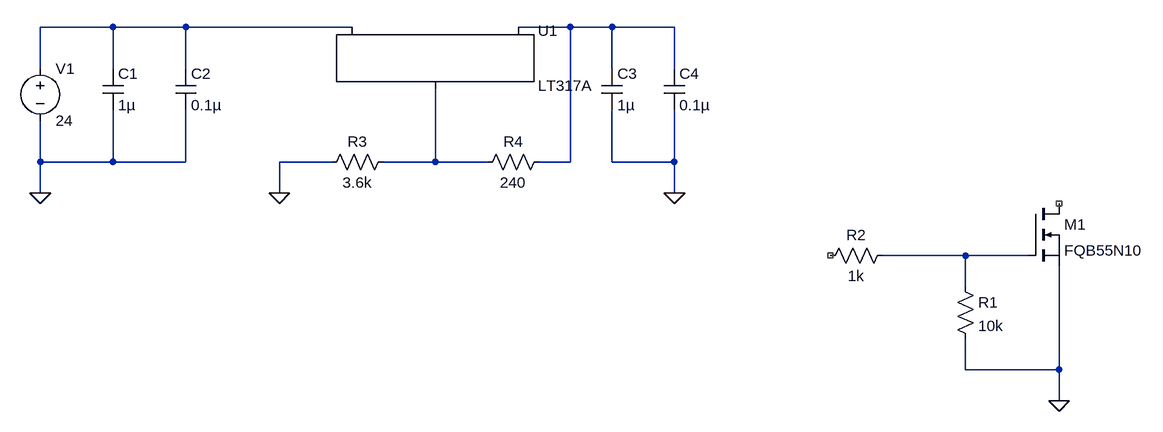
[diagram p0: schematic OverCurrent.asc]
OverCurrent.asc, the LTspice schematic file:
Version 4
SHEET 1 1096 680
WIRE -496 80 -608 80
WIRE -384 80 -496 80
WIRE -128 80 -384 80
WIRE 208 80 128 80
WIRE 272 80 208 80
WIRE 368 80 272 80
WIRE -608 144 -608 80
WIRE -496 144 -496 80
WIRE -384 144 -384 80
WIRE 272 144 272 80
WIRE 368 144 368 80
WIRE -608 288 -608 224
WIRE -496 288 -496 208
WIRE -496 288 -608 288
WIRE -384 288 -384 208
WIRE -384 288 -496 288
WIRE -160 288 -240 288
WIRE 0 288 0 176
WIRE 0 288 -80 288
WIRE 80 288 0 288
WIRE 208 288 208 80
WIRE 208 288 160 288
WIRE 272 288 272 208
WIRE 368 288 368 208
WIRE 368 288 272 288
WIRE -608 336 -608 288
WIRE -240 336 -240 288
WIRE 368 336 368 288
WIRE 816 432 688 432
WIRE 912 432 816 432
WIRE 816 480 816 432
WIRE 816 608 816 560
WIRE 960 608 960 448
WIRE 960 608 816 608
WIRE 960 656 960 608
FLAG 960 656 0
FLAG -608 336 0
FLAG -240 336 0
FLAG 368 336 0
SYMBOL PowerProducts\\LT317A 0 80 R0
SYMATTR InstName U1
SYMBOL nmos 912 352 R0
SYMATTR InstName M1
SYMATTR Value FQB55N10
SYMBOL res 800 464 R0
SYMATTR InstName R1
SYMATTR Value 10k
SYMATTR SpiceLine pwr=0.125
SYMBOL res 704 416 R90
WINDOW 0 0 56 VBottom 2
WINDOW 3 32 56 VTop 2
SYMATTR InstName R2
SYMATTR Value 1k
SYMATTR SpiceLine pwr=0.125
SYMBOL voltage -608 128 R0
WINDOW 123 0 0 Left 0
WINDOW 39 0 0 Left 0
SYMATTR InstName V1
SYMATTR Value 24
SYMBOL cap -512 144 R0
SYMATTR InstName C1
SYMATTR Value 1µ
SYMATTR SpiceLine V=50
SYMBOL cap -400 144 R0
SYMATTR InstName C2
SYMATTR Value 0.1µ
SYMATTR SpiceLine V=50
SYMBOL res -64 272 R90
WINDOW 0 0 56 VBottom 2
WINDOW 3 32 56 VTop 2
SYMATTR InstName R3
SYMATTR Value 3.6k
SYMATTR SpiceLine pwr=0.125
SYMBOL res 176 272 R90
WINDOW 0 0 56 VBottom 2
WINDOW 3 32 56 VTop 2
SYMATTR InstName R4
SYMATTR Value 240
SYMATTR SpiceLine pwr=0.125
SYMBOL cap 256 144 R0
SYMATTR InstName C3
SYMATTR Value 1µ
SYMATTR SpiceLine V=50
SYMBOL cap 352 144 R0
SYMATTR InstName C4
SYMATTR Value 0.1µ
SYMATTR SpiceLine V=50

The netlist it stands for:
* OverCurrent.asc
XU1 N003 N002 N001 LT317A
M1 NC_01 N004 0 0 FQB55N10
R1 N004 0 10k pwr=0.125
R2 N004 NC_02 1k pwr=0.125
V1 N001 0 24
C1 N001 0 1µ V=50
C2 N001 0 0.1µ V=50
R3 N003 0 3.6k pwr=0.125
R4 N002 N003 240 pwr=0.125
C3 N002 0 1µ V=50
C4 N002 0 0.1µ V=50
.model NMOS NMOS
.model PMOS PMOS
.lib standard.mos
.lib LTC.lib
.backanno
.end